# EAGLE schematic riser-1u-rj45-2x (EAGLE 4.16)
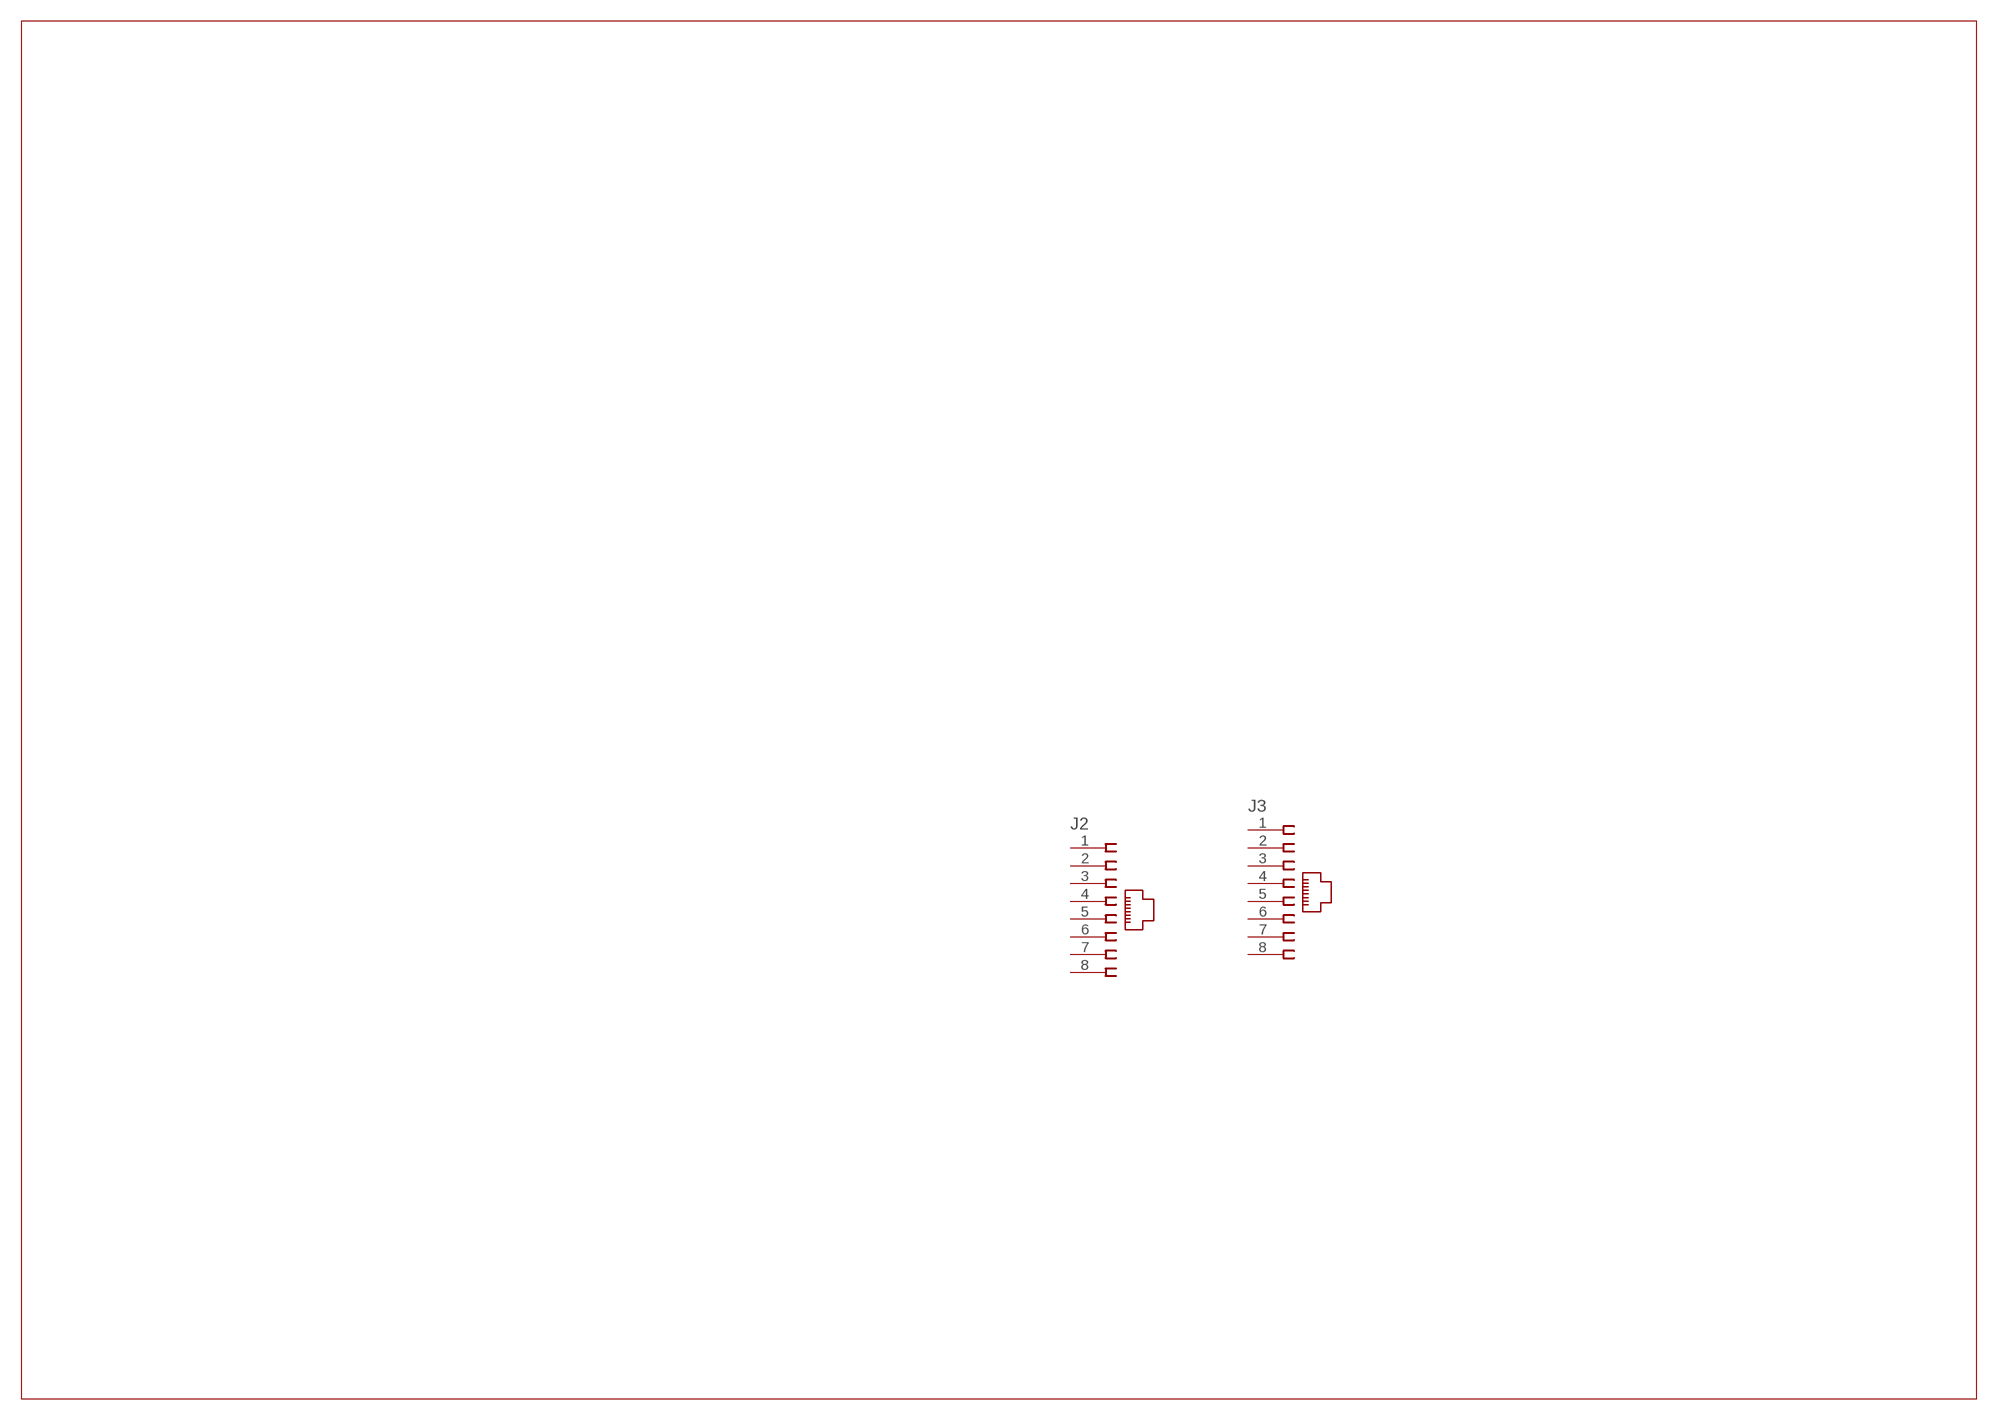
[diagram p0: schematic, sheet 1]

## Parts
J2  215877-4  [215877-4]
J3  215877-4  [215877-4]
Unconnected: J2.1 J2.2 J2.3 J2.4 J2.5 J2.6 J2.7 J2.8 J3.1 J3.2 J3.3 J3.4 J3.5 J3.6 J3.7 J3.8

## Library data of the parts
J2 J3 = con-amp:215877-4: AMP connector